# Altium project TCC.PrjPcb
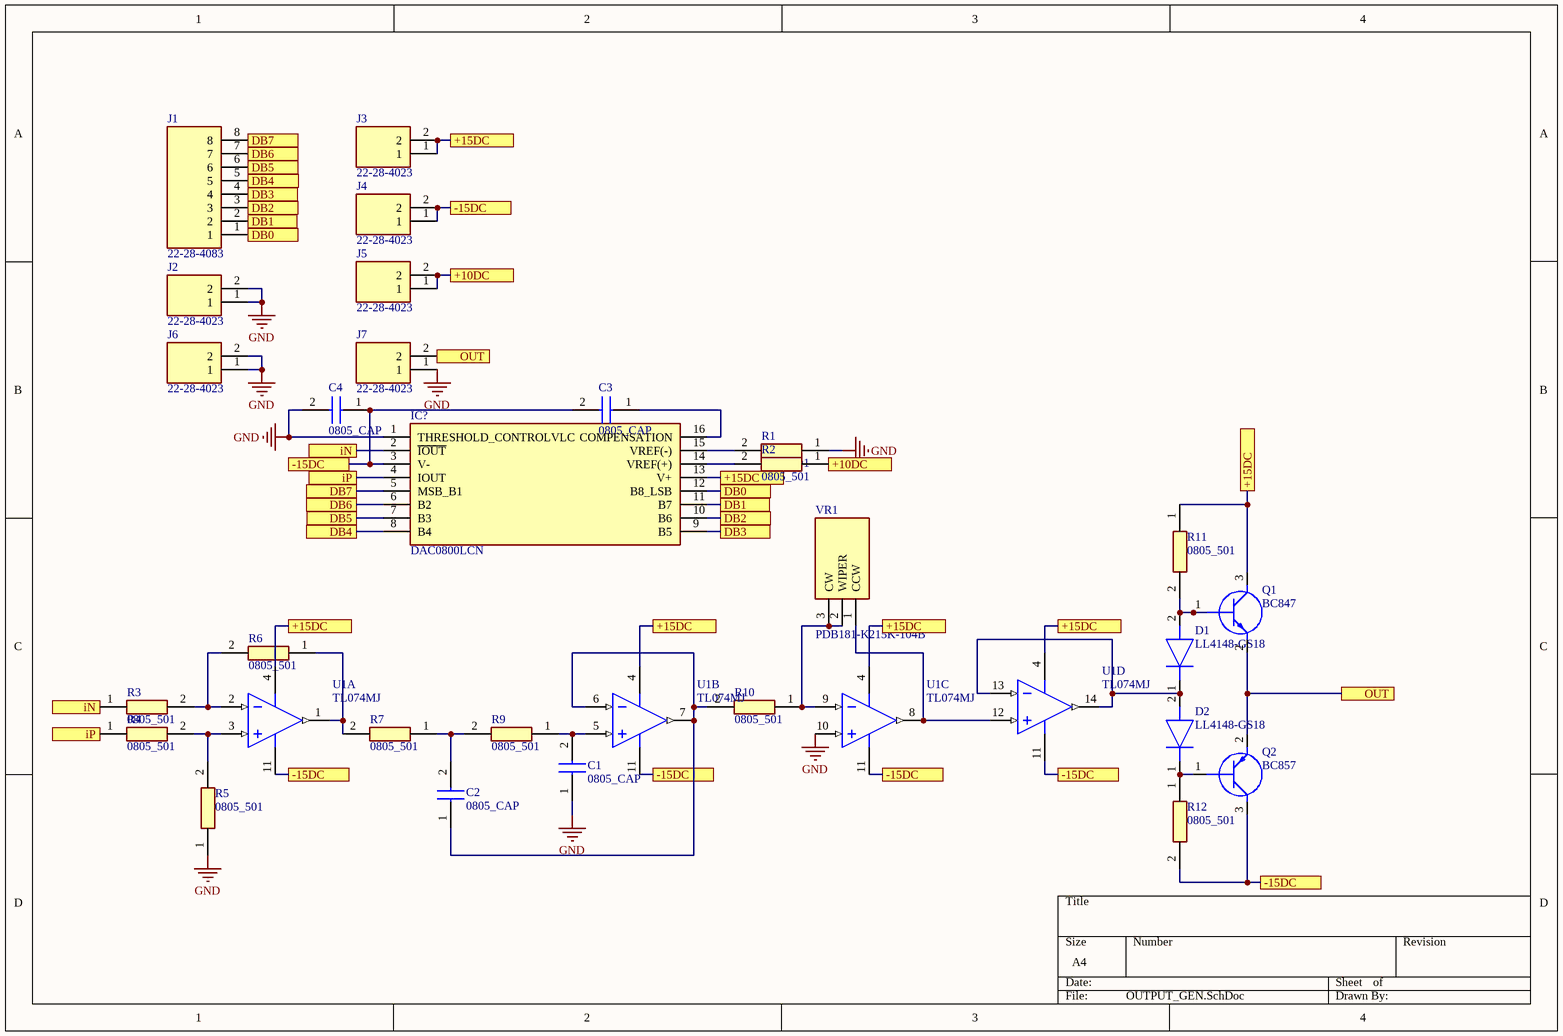
[diagram p0: OUTPUT_GEN.SchDoc]
1 sheet, 29 parts. Net scope: flat (ports and power ports of the same name join across sheets).
Board file: PCB1.PcbDoc

## Sheet OUTPUT_GEN.SchDoc
size A4; SheetNumber: 1; SheetTotal: 1

### Parts
C1  0805_CAP  [CAPC2012X130N]
C2  0805_CAP  [CAPC2012X130N]
C3  0805_CAP  [CAPC2012X130N]
C4  0805_CAP  [CAPC2012X130N]
D1  LL4148-GS18  [SOD-80]
D2  LL4148-GS18  [SOD-80]
IC1  DAC0800LCN  [DIP16]
J1  22-28-4083  [HDRV8W87P0X254_1X8_2032X249X863P]
J2  22-28-4023  [HDRV2W87P0X254_1X2_508X249X863P]
J3  22-28-4023  [HDRV2W87P0X254_1X2_508X249X863P]
J4  22-28-4023  [HDRV2W87P0X254_1X2_508X249X863P]
J5  22-28-4023  [HDRV2W87P0X254_1X2_508X249X863P]
J6  22-28-4023  [HDRV2W87P0X254_1X2_508X249X863P]
J7  22-28-4023  [HDRV2W87P0X254_1X2_508X249X863P]
Q1  BC847  [BC857215]
Q2  BC857  [BC857215]
R1  0805_501  [RESC2012X65N]
R2  0805_501  [RESC2012X65N]
R3  0805_501  [RESC2012X65N]
R4  0805_501  [RESC2012X65N]
R5  0805_501  [RESC2012X65N]
R6  0805_501  [RESC2012X65N]
R7  0805_501  [RESC2012X65N]
R9  0805_501  [RESC2012X65N]
R10  0805_501  [RESC2012X65N]
R11  0805_501  [RESC2012X65N]
R12  0805_501  [RESC2012X65N]
U1  TL074MJ  [DIP14]  (parts A,B,C,D of 4)
VR1  PDB181-K215K-104B  [PDB181K220K104B]

### Ports
+10DC (see OUTPUT_GEN[2B]), +10DC (see OUTPUT_GEN[3B]), +15DC (see OUTPUT_GEN[1C], OUTPUT_GEN[2A], OUTPUT_GEN[2B], OUTPUT_GEN[2C], OUTPUT_GEN[3C]), +15DC (see OUTPUT_GEN[1C], OUTPUT_GEN[2A], OUTPUT_GEN[2B], OUTPUT_GEN[2C], OUTPUT_GEN[3C], OUTPUT_GEN[4B]), +15DC (see OUTPUT_GEN[1C], OUTPUT_GEN[2A], OUTPUT_GEN[2B], OUTPUT_GEN[3C], OUTPUT_GEN[4B]), +15DC (see OUTPUT_GEN[1C], OUTPUT_GEN[2A], OUTPUT_GEN[2C], OUTPUT_GEN[3C], OUTPUT_GEN[4B]), +15DC (see OUTPUT_GEN[1C], OUTPUT_GEN[2B], OUTPUT_GEN[2C], OUTPUT_GEN[3C], OUTPUT_GEN[4B]), +15DC (see OUTPUT_GEN[2A], OUTPUT_GEN[2B], OUTPUT_GEN[2C], OUTPUT_GEN[3C], OUTPUT_GEN[4B]), -15DC (see OUTPUT_GEN[1B], OUTPUT_GEN[1D], OUTPUT_GEN[2A], OUTPUT_GEN[2D], OUTPUT_GEN[3D]), -15DC (see OUTPUT_GEN[1B], OUTPUT_GEN[1D], OUTPUT_GEN[2A], OUTPUT_GEN[2D], OUTPUT_GEN[3D], OUTPUT_GEN[4D]), -15DC (see OUTPUT_GEN[1B], OUTPUT_GEN[1D], OUTPUT_GEN[2A], OUTPUT_GEN[3D], OUTPUT_GEN[4D]), -15DC (see OUTPUT_GEN[1B], OUTPUT_GEN[1D], OUTPUT_GEN[2D], OUTPUT_GEN[3D], OUTPUT_GEN[4D]), -15DC (see OUTPUT_GEN[1B], OUTPUT_GEN[2A], OUTPUT_GEN[2D], OUTPUT_GEN[3D], OUTPUT_GEN[4D]), -15DC (see OUTPUT_GEN[1D], OUTPUT_GEN[2A], OUTPUT_GEN[2D], OUTPUT_GEN[3D], OUTPUT_GEN[4D]), DB0 (see OUTPUT_GEN[1A]), DB0 (see OUTPUT_GEN[2B]), DB1 (see OUTPUT_GEN[1A]), DB1 (see OUTPUT_GEN[2B]), DB2 (see OUTPUT_GEN[1A]), DB2 (see OUTPUT_GEN[2C]), DB3 (see OUTPUT_GEN[1A]), DB3 (see OUTPUT_GEN[2C]), DB4 (see OUTPUT_GEN[1A]), DB4 (see OUTPUT_GEN[1C]), DB5 (see OUTPUT_GEN[1A]), DB5 (see OUTPUT_GEN[1C]), DB6 (see OUTPUT_GEN[1A]), DB6 (see OUTPUT_GEN[1B]), DB7 (see OUTPUT_GEN[1A]), DB7 (see OUTPUT_GEN[1B]), iN (see OUTPUT_GEN[1B]), iN (see OUTPUT_GEN[1C]), iP (see OUTPUT_GEN[1B]), iP (see OUTPUT_GEN[1C]), OUT (see OUTPUT_GEN[2B]), OUT (see OUTPUT_GEN[4C])

### Nets
GND: C1.1 C4.2 IC1.1(THRESHOLD_CONTROLVLC) J2.1 J2.2 J6.1 J6.2 J7.1 R1.1 R5.1 U1.10(IN3+)
NetC1_2: C1.2 R9.1 U1.5(IN2+)
NetC2_1: C2.1 R10.2 U1.6(IN2-) U1.7(OUT2)
NetC2_2: C2.2 R7.1 R9.2
NetC3_1: C3.1 IC1.16(COMPENSATION)
NetC3_2: C3.2 C4.1 IC1.3(V-) J4.1 J4.2 Q2.3(C) R12.2 U1.11(VCC-) ; port -15DC
NetD1_1: D1.1(K) D2.2(A) U1.13(IN4-) U1.14(OUT4)
NetD1_2: D1.2(A) Q1.1(B) R11.2
NetD2_1: D2.1(K) Q2.1(B) R12.1
NetIC1_2: IC1.2(~{IOUT}) R3.1 ; port iN
NetIC1_4: IC1.4(IOUT) R4.1 ; port iP
NetIC1_5: IC1.5(MSB_B1) J1.8 ; port DB7
NetIC1_6: IC1.6(B2) J1.7 ; port DB6
NetIC1_7: IC1.7(B3) J1.6 ; port DB5
NetIC1_8: IC1.8(B4) J1.5 ; port DB4
NetIC1_9: IC1.9(B5) J1.4 ; port DB3
NetIC1_10: IC1.10(B6) J1.3 ; port DB2
NetIC1_11: IC1.11(B7) J1.2 ; port DB1
NetIC1_12: IC1.12(B8_LSB) J1.1 ; port DB0
NetIC1_13: IC1.13(V+) J3.1 J3.2 Q1.3(C) R11.1 U1.4(VCC+) ; port +15DC
NetIC1_14: IC1.14(VREF(+)) R2.2
NetIC1_15: IC1.15(VREF(-)) R1.2
NetJ5_1: J5.1 J5.2 R2.1 ; port +10DC
NetJ7_2: J7.2 Q1.2(E) Q2.2(E) ; port OUT
NetR3_2: R3.2 R6.2 U1.2(IN1-)
NetR4_2: R4.2 R5.2 U1.3(IN1+)
NetR6_1: R6.1 R7.2 U1.1(OUT1)
NetR10_1: R10.1 U1.9(IN3-) VR1.2(WIPER) VR1.3(CW)
NetU1_8: U1.8(OUT3) U1.12(IN4+) VR1.1(CCW)

### Library data of the parts
D1 D2 = LL4148-GS18: Diode; Manufacturer_Name: Vishay; Datasheet Link: https://www.vishay.com/docs/85557/ll4148.pdf; Manufacturer_Part_Number: LL4148-GS18; Mouser Part Number: 78-LL4148-GS18; Mouser Price/Stock: https://www.mouser.co.uk/ProductDetail/Vishay-Semiconductors/LL4148-GS18?qs=YkIJFe%252BtFEUsKqcD4T1jvg%3D%3D; Arrow Part Number: LL4148-GS18; Arrow Price/Stock: https://www.arrow.com/en/products/ll4148-gs18/vishay.html?utm_currency=USD&region=europe
IC1 = DAC0800LCN: Integrated Circuit; Manufacturer_Name: Texas Instruments; Datasheet Link: https://www.ti.com/lit/ds/symlink/dac0800.pdf; Height: 4.318mm; Manufacturer_Part_Number: DAC0800LCN; Mouser Part Number: 926-DAC0800LCN; Mouser Price/Stock: https://www.mouser.co.uk/ProductDetail/Texas-Instruments/DAC0800LCN?qs=7X5t%252BdzoRHAPBuJSmu%2FDTw%3D%3D
J1 = 22-28-4083: Connector; Manufacturer_Name: Molex; Datasheet Link: https://componentsearchengine.com/Datasheets/1/22-28-4083.pdf; Height: 8.63mm; Manufacturer_Part_Number: 22-28-4083; Mouser Part Number: 538-22-28-4083; Mouser Price/Stock: https://www.mouser.co.uk/ProductDetail/Molex/22-28-4083?qs=d9fIA1aNikQMlX6q%252Bcx1qQ%3D%3D
J2-J7 = 22-28-4023: Connector; Manufacturer_Name: Molex; Datasheet Link: http://www.molex.com/molex/products/datasheet.jsp?part=active/0022284023_PCB_HEADERS.xml; Height: 8.63mm; Manufacturer_Part_Number: 22-28-4023; Mouser Part Number: 538-22-28-4023; Mouser Price/Stock: https://www.mouser.co.uk/ProductDetail/Molex/22-28-4023?qs=MuwpYaHj750gid5X5P2KgQ%3D%3D
U1 = TL074: High Speed Low-Noise JFET-Input Quad Operational Amplifier, -55 to 125 degC, 14-pin DIP (J14); Manufacturer: Texas Instruments; Slew Rate(Typ)(V/us): 13; IIB(Max)(pA): 200; CMRR(Min)(dB): 80; Sub Family: General Purpose Amplifier; Vio (25C)(Max)(mV): 9; PackageVersion: 4040083/F, 03/2003; ComponentLink1Description: Manufacturer URL; ComponentLink1URL: http://www.ti.com/; ComponentLink2Description: Datasheet; PartNumber: TL074MJ; DatasheetVersion: SLOS080J; PackageReference: J0014A; ComponentLink2URL: http://www.ti.com/lit/ds/symlink/tl074m.pdf; ComponentLink3URL: http://www.ti.com/litv/pdf/mcer002d; PackageDescription: 14-Pin Ceramic, Glass In-Line, Row Spacing 7.62 mm, Pitch 2.54 mm; Mounting Technology: Through Hole; ComponentLink3Description: Package Specification
VR1 = PDB181-K215K-104B: Variable Resistor; Manufacturer_Name: Bourns; Datasheet Link: https://www.mouser.com/datasheet/2/54/PDB18-1013655.pdf; Height: 16.5mm; Manufacturer_Part_Number: PDB181-K215K-104B; Mouser Part Number: 652-PDB181-K215K104B; Mouser Price/Stock: https://www.mouser.co.uk/ProductDetail/Bourns/PDB181-K215K-104B?qs=gZXFycFWdAN%2FSIUM%252BvBwGA%3D%3D